# Altium schematic sheet Source.SchDoc
size B; SheetNumber: 1; SheetTotal: 2
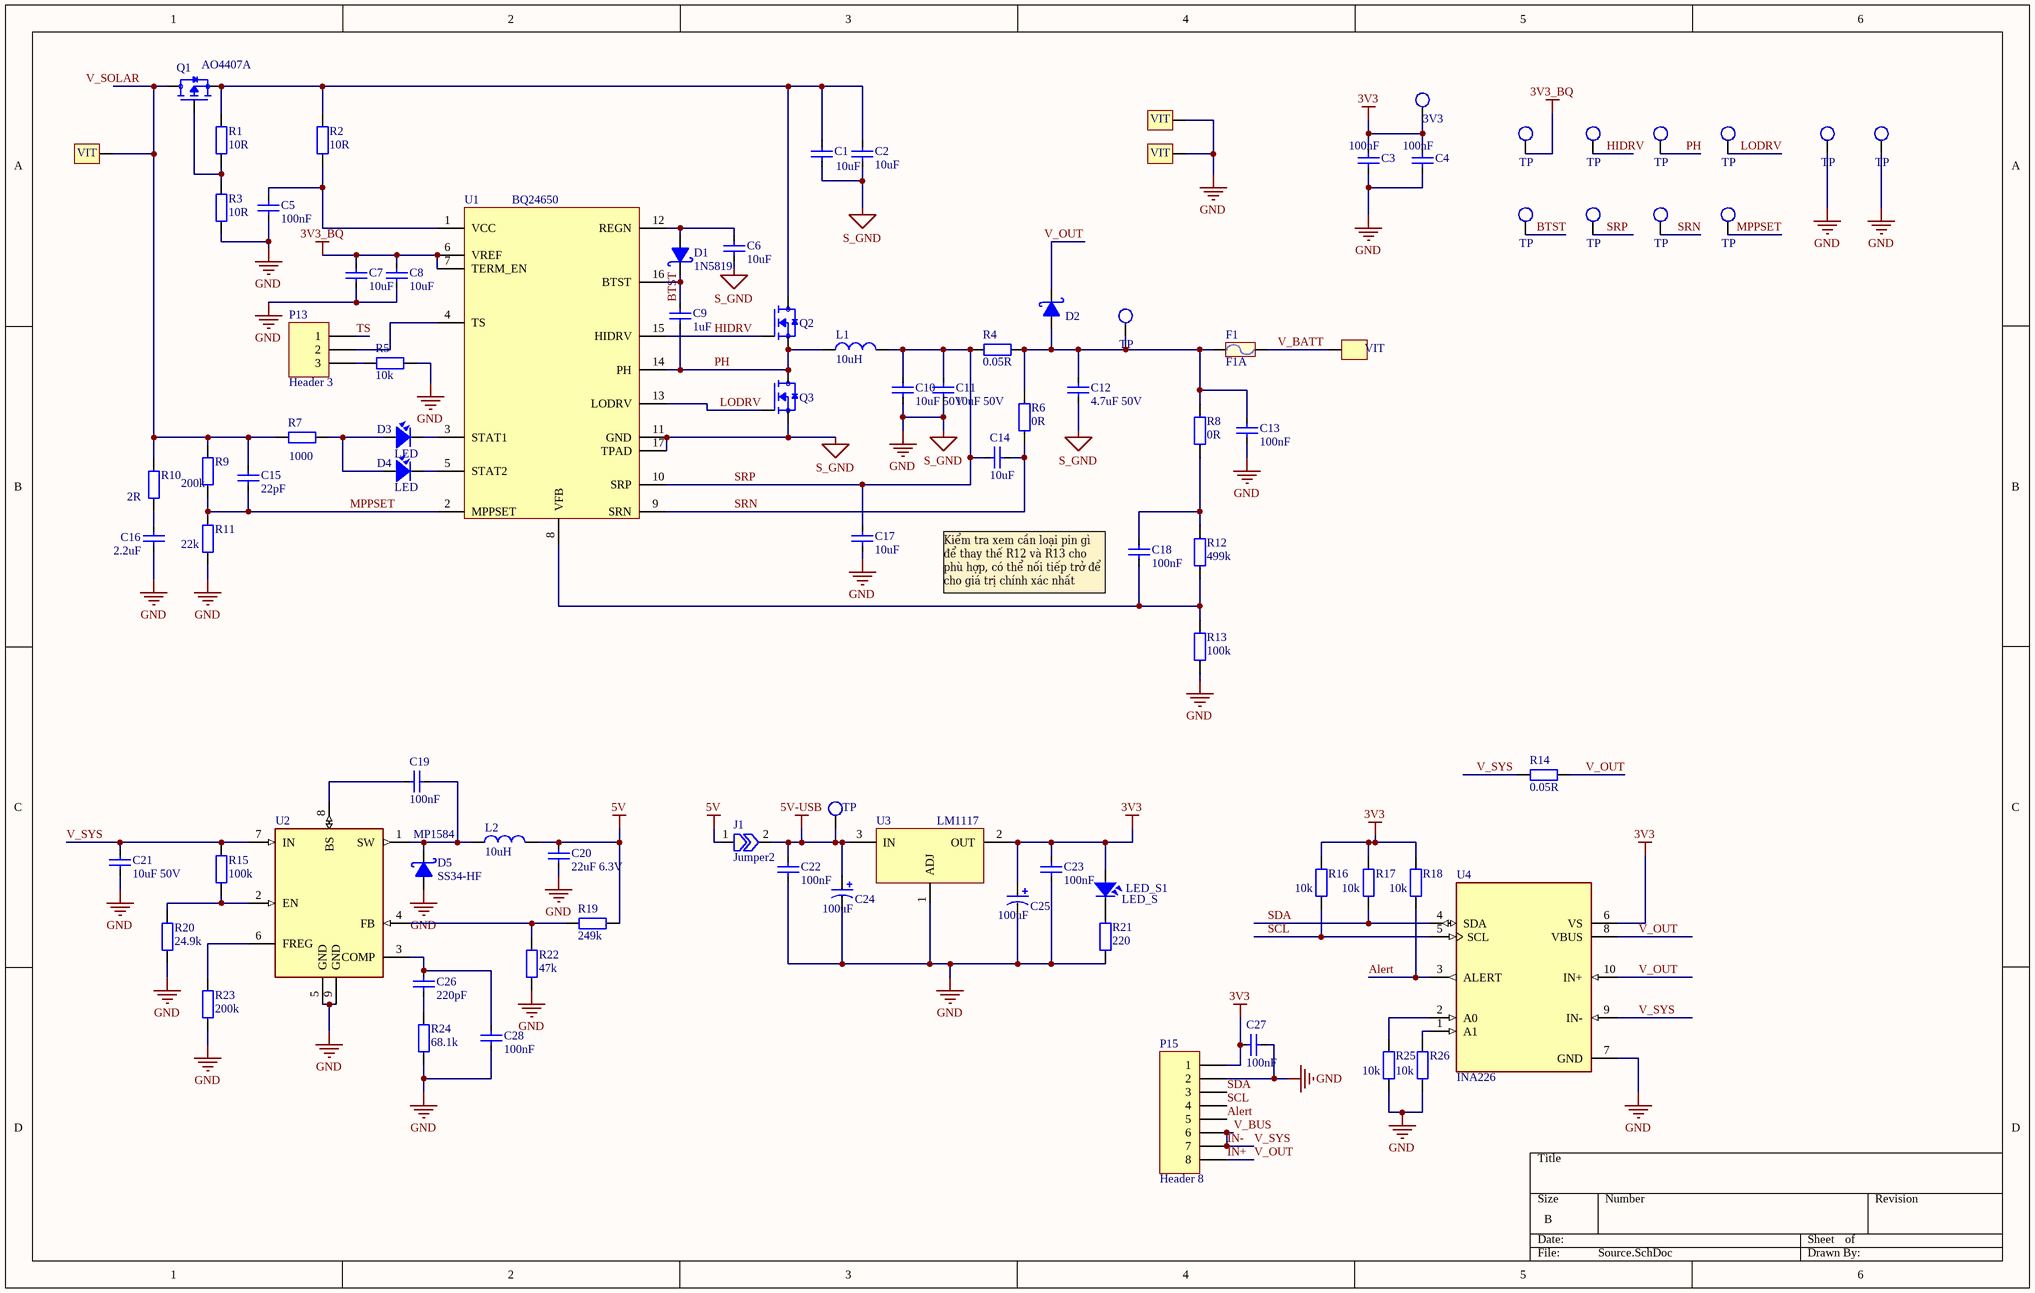
[diagram p0: Source.SchDoc]

## Parts
C1  10uF  [CAP_3216]
C2  10uF  [CAP_3216]
C3  100nF  [CAP_0805]
C4  100nF  [CAP_0805]
C5  100nF  [CAP_0805]
C6  10uF  [CAP_0805]
C7  10uF  [CAP_0805]
C8  10uF  [CAP_0805]
C9  1uF  [CAP_0805]
C10  10uF 50V  [CAP_1206]
C11  10uF 50V  [CAP_1206]
C12  4.7uF 50V  [CAP_1206]
C13  100nF  [CAP_0805]
C14  10uF  [CAP_0805]
C15  22pF  [CAP_0805]
C16  2.2uF  [CAP_0805]
C17  10uF  [CAP_0805]
C18  100nF  [CAP_0805]
C19  100nF  [CAP_0805]
C20  22uF 6.3V  [CAP_0805]
C21  10uF 50V  [CAP_3216]
C22  100nF  [CAP_0805]
C23  100nF  [CAP_0805]
C24  100uF  [CAP_7343]
C25  100uF  [CAP_7343]
C26  220pF  [CAP_0805]
C27  100nF  [CAP_0805]
C28  100nF  [CAP_0805]
D1  1N5819  [DIO-SMD-123]
D2  Diode Schottky  [DIO-214AA(SMB)]  (value not drawn)
D3  LED  [LED-0805-Green]
D4  LED  [LED-0805-Red]
D5  SS34-HF  [SMA]
F1  F1A  [RES-SMD-1812]
J1  Jumper2  [RES-SMD-0402]  (no BOM)
L1  10uH  [L-SMD-M-12x10]
L2  10uH  [L-SMD-M-7.3x4.5]
LED_S1  LED_S  [LED-0805-Blue]
P1  3V3  [Testpoint 50ml]  (no BOM)
P2  TP  [Testpoint 50ml]  (no BOM)
P3  TP  [Testpoint 50ml]  (no BOM)
P4  TP  [Testpoint 50ml]  (no BOM)
P5  TP  [Testpoint 50ml]  (no BOM)
P6  TP  [Testpoint 50ml]  (no BOM)
P7  TP  [Testpoint 50ml]  (no BOM)
P8  TP  [Testpoint 50ml]  (no BOM)
P9  TP  [Testpoint 50ml]  (no BOM)
P10  TP  [Testpoint 50ml]  (no BOM)
P11  TP  [Testpoint 50ml]  (no BOM)
P12  TP  [Testpoint 50ml]  (no BOM)
P13  Header 3  [HDR1X3]  (no BOM)
P14  TP  [Testpoint 50ml]  (no BOM)
P15  Header 8  [HDR1X8]  (no BOM)
Q1  AO4407A  [SOIC-8]
Q2  AON6508  [MOSFET_HP_8Pin]  (value not drawn)
Q3  AON6508  [MOSFET_HP_8Pin]  (value not drawn)
R1  10R  [RES-SMD-0805]
R2  10R  [RES-SMD-0805]
R3  10R  [RES-SMD-0805]
R4  0.05R  [RES-SMD-2512]
R5  10k  [RES-SMD-0805]
R6  0R  [RES-SMD-0805]
R7  1000  [RES-SMD-0805]
R8  0R  [RES-SMD-0805]
R9  200k  [RES-SMD-0805]
R10  2R  [RES-SMD-2512]
R11  22k  [RES-SMD-0805]
R12  499k  [RES-SMD-0805]
R13  100k  [RES-SMD-0805]
R14  0.05R  [RES-SMD-2512]
R15  100k  [RES-SMD-0805]
R16  10k  [RES-SMD-0805]
R17  10k  [RES-SMD-0805]
R18  10k  [RES-SMD-0805]
R19  249k  [RES-SMD-0805]
R20  24.9k  [RES-SMD-0805]
R21  220  [RES-SMD-0805]
R22  47k  [RES-SMD-0805]
R23  200k  [RES-SMD-0805]
R24  68.1k  [RES-SMD-0805]
R25  10k  [RES-SMD-0805]
R26  10k  [RES-SMD-0805]
U1  BQ24650  [VQFN-16]
U2  MP1584  [SOP8-PP]
U3  LM1117  [SOT-223]
U4  INA226  [VSSOP-10]
VIT1  1  [VIT]  (value not drawn)  (no BOM)
VIT2  1  [VIT]  (value not drawn)  (no BOM)
VIT3  1  [VIT]  (value not drawn)  (no BOM)
VIT4  1  [VIT]  (value not drawn)  (no BOM)

## Nets
3V3: C3.2 C4.2 C23.2 C25.1 C27.2 LED_S1.1 P1.1 P15.1 R16.1 R17.1 R18.1 U3.2(OUT) U4.6(VS)
3V3_BQ: C7.2 C8.2 P2.1 U1.6(VREF) U1.7(TERM_EN)
5V: C20.2 J1.1 L2.2 R19.1
5V-USB: C22.2 C24.1 J1.2 P14.1 U3.3(IN)
GND: C1.1 C2.1 C3.1 C4.1 C5.1 C6.1 C7.1 C8.1 C10.1 C11.1 C12.2 C13.1 C16.1 C17.1 C20.1 C21.1 C22.1 C23.1 C24.2 C25.2 C27.1 C28.1 D5.1(A) P6.1 P7.1 P15.2 Q3.1,2,3(S) R3.2 R5.2 R11.2 R13.2 R20.2 R21.2 R22.2 R23.2 R24.2 R25.2 R26.2 U1.11(GND) U1.17(TPAD) U2.5(GND) U2.9(GND) U3.1(ADJ) U4.7(GND) VIT1.VIT1 VIT3.VIT1  [also labelled S_GND]
Alert: P15.5 R18.2 U4.3(ALERT)
BTST: C9.2 D1.2(K) P8.1 U1.16(BTST)
HIDRV: P3.1 Q2.4(G) U1.15(HIDRV)
IN+: D2.2(K) P15.8 R14.1 U4.8(VBUS) U4.10(IN+)  [also labelled V_OUT]
IN-: C21.2 P15.6 P15.7 R14.2 R15.1 U2.7(IN) U4.9(IN-)  [also labelled V_BUS, V_SYS]
LODRV: P5.1 Q3.4(G) U1.13(LODRV)
MPPSET: C15.1 P11.1 R9.2 R11.1 U1.2(MPPSET)
PH: C9.1 L1.1 P4.1 Q2.1,2,3(S) Q3.5,6,7,8,9(D) U1.14(PH)
SCL: P15.4 R16.2 U4.5(SCL)
SDA: P15.3 R17.2 U4.4(SDA)
SRN: C14.1 P10.1 R6.2 U1.9(SRN)
SRP: C10.2 C11.2 C14.2 C17.2 L1.2 P9.1 R4.2 U1.10(SRP)
TS: P13.1
V_BATT: F1.2 VIT4.VIT1
V_SOLAR: C15.2 Q1.5,_6,_7,_8(D) R7.2 R9.1 R10.1 VIT2.VIT1
NetC1_2: C1.2 C2.2 Q1.1,_2,_3(S) Q2.5,6,7,8,9(D) R1.1 R2.1
NetC5_2: C5.2 R2.2 U1.1(VCC)
NetC6_2: C6.2 D1.1(A) U1.12(REGN)
NetC12_1: C12.1 C13.2 D2.1(A) F1.1 P12.1 R4.1 R6.1 R8.1
NetC16_2: C16.2 R10.2
NetC18_1: C18.1 R12.2 R13.1 U1.8(VFB)
NetC18_2: C18.2 R8.2 R12.1
NetC19_1: C19.1 U2.8(BS)
NetC19_2: C19.2 D5.2(K) L2.1 U2.1(SW)
NetC26_1: C26.1 R24.1
NetC26_2: C26.2 C28.2 U2.3(COMP)
NetD3_1: D3.1 D4.1 R7.1
NetD3_2: D3.2 U1.3(STAT1)
NetD4_2: D4.2 U1.5(STAT2)
NetLED_S1_2: LED_S1.2 R21.1
NetP13_2: P13.2 U1.4(TS)
NetP13_3: P13.3 R5.1
NetQ1_4: Q1.4(G) R1.2 R3.1
NetR15_2: R15.2 R20.1 U2.2(EN)
NetR19_2: R19.2 R22.1 U2.4(FB)
NetR23_1: R23.1 U2.6(FREG)
NetR25_1: R25.1 U4.2(A0)
NetR26_1: R26.1 U4.1(A1)

## Notes on the sheet
- (near C18) Kiểm tra xem cần loại pin gì để thay thế R12 và R13 cho phù hợp, có thể nối tiếp trở để cho giá trị chính xác nhất

## Library data of the parts
C1 C2 = CapSMD: C 3216; Value: 33p; Published: 8-Jun-2000; LatestRevisionDate: 17-Jul-2002; LatestRevisionNote: Re-released for DXP Platform.; PackageReference: RAD-0.3; Publisher: Altium Limited
C3-C9 C13-C20 C22 C23 C26-C28 = CapSMD: C 0805; Value: 33p; Published: 8-Jun-2000; LatestRevisionDate: 17-Jul-2002; LatestRevisionNote: Re-released for DXP Platform.; PackageReference: RAD-0.3; Publisher: Altium Limited
C10-C12 C21 = CapSMD: C 1206; Value: 33p; Published: 8-Jun-2000; LatestRevisionDate: 17-Jul-2002; LatestRevisionNote: Re-released for DXP Platform.; PackageReference: RAD-0.3; Publisher: Altium Limited
C24 C25 = CAP_TAN_SMD: C Tan 7343
D1 D5 = 1N5822: Schottky Rectifiers; Value: Diode c?m 1N5408
D2 = Diode Schottky: SS54
D3 D4 LED_S1 = LED: LED Single colour Green and Red; Value: LED 3 ly Single Colour
F1 = Fuse: Fuse 5A; Designed by: VanDungEvn; Value: Fuse
J1 = Jumper2: Jumper, 2-Pin
L1 = Inductor: Value: 150 mH
L2 = Inductor: 6.8-10uH; Value: 150 mH
P1-P12 P14 = TP_1: Test Point; Value: Test Point
P13 = Header 3: Header, 3-Pin; LatestRevisionDate: 17-Jul-2002; LatestRevisionNote: Re-released for DXP Platform.; Publisher: Altium Limited
P15 = Header 8: Header, 8-Pin; LatestRevisionDate: 17-Jul-2002; LatestRevisionNote: Re-released for DXP Platform.; Publisher: Altium Limited
Q1 = MOSFET-P: MFET-ChP; ComponentLink1Description: New link; ComponentLink1URL: https://linhkien.cxtvn.com/3834-ru20p7c-mosfet-p-ch-5a-20v-sot-23.html
Q2 Q3 = MOSFET-N: MFET-CHP
R1-R3 R5-R7 R15-R18 R21 R23-R26 = Resistor - SMD: R 0805; Manufacturer: Generic Components; Class: Passive; Published: 08/06/2000; Publisher: Altium Hobart Technology Centre
R4 R14 = Resistor - SMD: R 2512 1%; Manufacturer: Generic Components; Class: Passive; Published: 08/06/2000; Publisher: Altium Hobart Technology Centre
R8 R9 R11-R13 R19 R20 R22 = Resistor - SMD: R 0805 1%; Manufacturer: Generic Components; Class: Passive; Published: 08/06/2000; Publisher: Altium Hobart Technology Centre
R10 = Resistor - SMD: R 2512; Manufacturer: Generic Components; Class: Passive; Published: 08/06/2000; Publisher: Altium Hobart Technology Centre
U1 = BQ24650: BQ24650 Stand-Alone Synchronous Buck Battery Charge Controller for Solar Power / With Maximum Power Point Tracking
U2 = MP1584: MP1584, The wide 4.5V to 28V input range accommodates a   variety   of   step-down   applications, SOIC8E
U3 = LM1117: 3V3 5V LDO, AMS1117, LDI1117; Creator: Nguyen Ba Bien; Website: http://group3i.net
U4 = INA226: Current Sensing IC
VIT1-VIT4 = VIT: Oc Vit